# Altium schematic sheet 12.MiniPcie-4G.SchDoc
size A4; CheckedBy: YPC; DocumentNumber: 12; Revision: V1.00; SheetNumber: 12; SheetTotal: 18; SheetName: MiniPcie-4G; SheetDescribe: MiniPcie-4G/USB2.0; Designer: JOW; DesignDate: 2025-04-25; CheckedData: 2025-04-25; Rule: PcbType=ProtelPcb
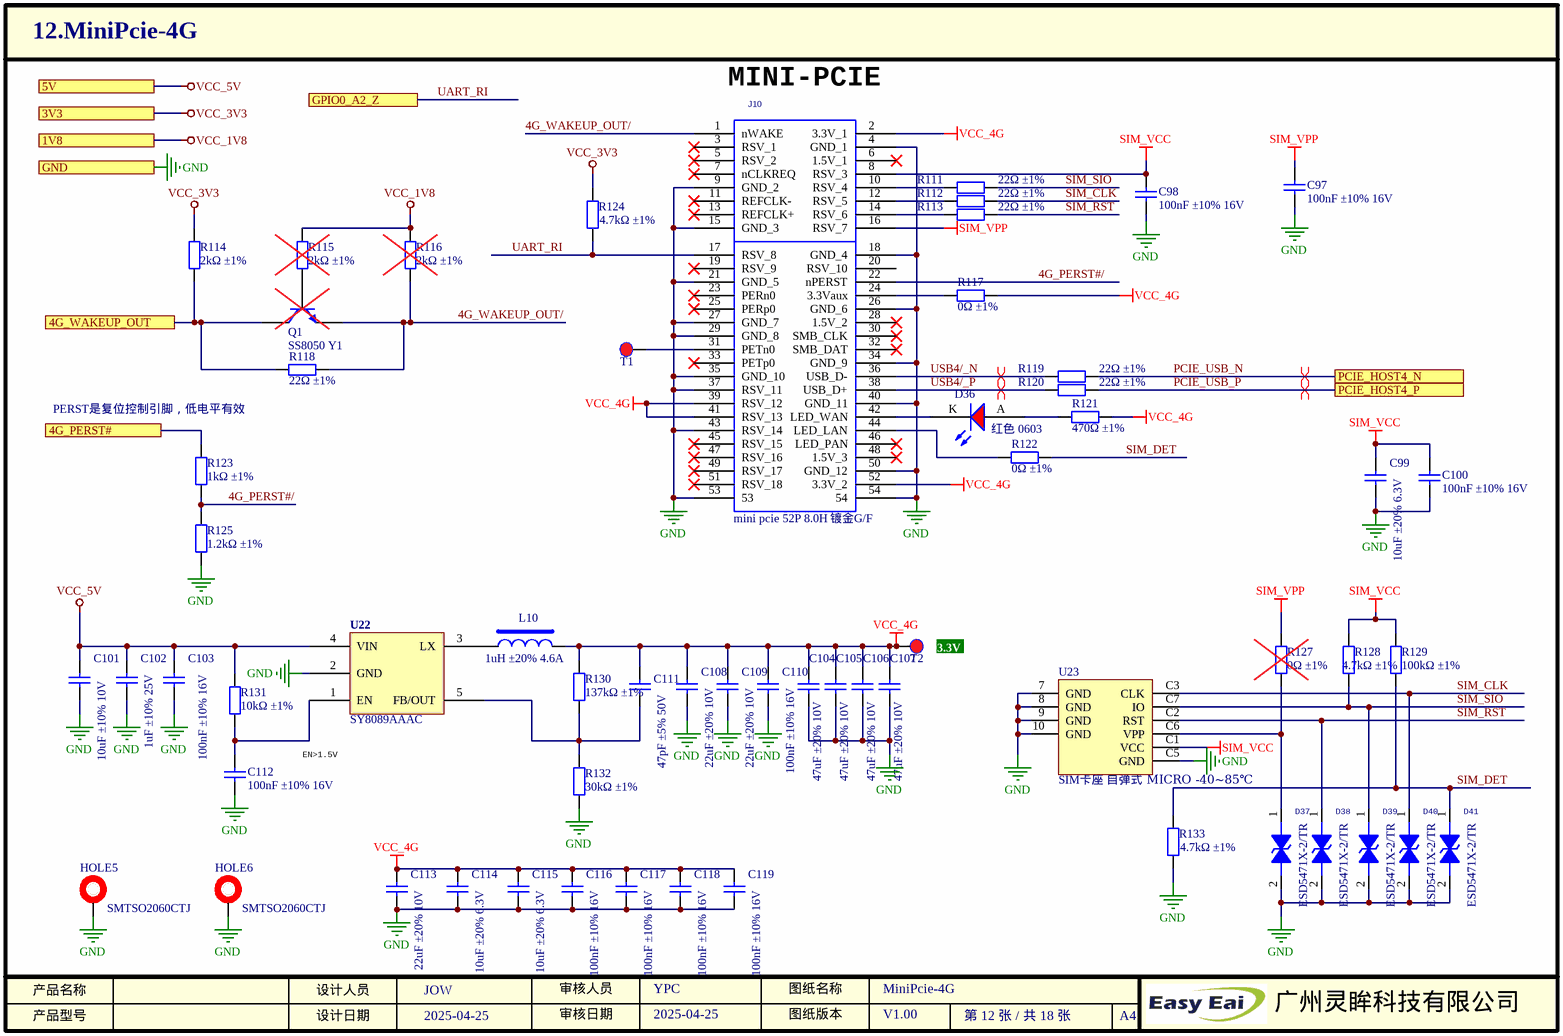
[diagram p0: 12.MiniPcie-4G.SchDoc]

## Parts
C97  描述: 100nF ±10% 16V  [0402_C]  (hidden comment: CL05B104KO5NNNC)
C98  描述: 100nF ±10% 16V  [0402_C]  (hidden comment: CL05B104KO5NNNC)
C99  描述: 10uF ±20% 6.3V  [0402_C]  (hidden comment: CL05A106MQ5NUNC)
C100  描述: 100nF ±10% 16V  [0402_C]  (hidden comment: CL05B104KO5NNNC)
C101  描述: 10uF ±10% 10V  [0603_C]  (hidden comment: CL10A106KP8NNNC)
C102  描述: 1uF ±10% 25V  [0402_C]  (hidden comment: CL05A105KA5NQNC)
C103  描述: 100nF ±10% 16V  [0402_C]  (hidden comment: CL05B104KO5NNNC)
C104  描述: 47uF ±20% 10V  [0805_C]  (hidden comment: C2012X5R1A476MTJ00E)
C105  描述: 47uF ±20% 10V  [0805_C]  (hidden comment: C2012X5R1A476MTJ00E)
C106  描述: 47uF ±20% 10V  [0805_C]  (hidden comment: C2012X5R1A476MTJ00E)
C107  描述: 47uF ±20% 10V  [0805_C]  (hidden comment: C2012X5R1A476MTJ00E)
C108  描述: 22uF ±20% 10V  [0603_C]  (hidden comment: CL10A226MP8NUNE)
C109  描述: 22uF ±20% 10V  [0603_C]  (hidden comment: CL10A226MP8NUNE)
C110  描述: 100nF ±10% 16V  [0402_C]  (hidden comment: CL05B104KO5NNNC)
C111  描述: 47pF ±5% 50V  [0402_C]  (hidden comment: NC/0402CG470J500NT)
C112  描述: 100nF ±10% 16V  [0402_C]  (hidden comment: CL05B104KO5NNNC)
C113  描述: 22uF ±20% 10V  [0603_C]  (hidden comment: CL10A226MP8NUNE)
C114  描述: 10uF ±20% 6.3V  [0402_C]  (hidden comment: CL05A106MQ5NUNC)
C115  描述: 10uF ±20% 6.3V  [0402_C]  (hidden comment: CL05A106MQ5NUNC)
C116  描述: 100nF ±10% 16V  [0402_C]  (hidden comment: CL05B104KO5NNNC)
C117  描述: 100nF ±10% 16V  [0402_C]  (hidden comment: CL05B104KO5NNNC)
C118  描述: 100nF ±10% 16V  [0402_C]  (hidden comment: CL05B104KO5NNNC)
C119  描述: 100nF ±10% 16V  [0402_C]  (hidden comment: CL05B104KO5NNNC)
D36  红色 0603  [0603_LED_S1]
D37  ESD5471X-2/TR  [FBP-02C]
D38  ESD5471X-2/TR  [FBP-02C]
D39  ESD5471X-2/TR  [FBP-02C]
D40  ESD5471X-2/TR  [FBP-02C]
D41  ESD5471X-2/TR  [FBP-02C]
HOLE5  SMTSO2060CTJ  [Mou Hole-373D600H-SMD]
HOLE6  SMTSO2060CTJ  [Mou Hole-373D600H-SMD]
J10  91304-80-052R2  [MEDC52-32F-PCIE-LOCK-L]  (value not drawn)
L10  WPN252010U1R0MT  [1008]  (value not drawn)
Q1  型号: SS8050 Y1  [SOT-23(SOT-23-3)]  (hidden comment: NC/SS8050 Y1)  (no BOM)
R111  描述: 22Ω ±1%  [0402_R]  (hidden comment: 0402WGF220JTCE)
R112  描述: 22Ω ±1%  [0402_R]  (hidden comment: 0402WGF220JTCE)
R113  描述: 22Ω ±1%  [0402_R]  (hidden comment: 0402WGF220JTCE)
R114  描述: 2kΩ ±1%  [0402_R]  (hidden comment: 0402WGF2001TCE)
R115  描述: 2kΩ ±1%  [0402_R]  (hidden comment: NC/0402WGF2001TCE)  (no BOM)
R116  描述: 2kΩ ±1%  [0402_R]  (hidden comment: NC/0402WGF2001TCE)  (no BOM)
R117  描述: 0Ω ±1%  [0402_R]  (hidden comment: 0402WGF0000TCE)
R118  描述: 22Ω ±1%  [0402_R]  (hidden comment: 0402WGF220JTCE)
R119  描述: 22Ω ±1%  [0402_R]  (hidden comment: 0402WGF220JTCE)
R120  描述: 22Ω ±1%  [0402_R]  (hidden comment: 0402WGF220JTCE)
R121  描述: 470Ω ±1%  [0402_R]  (hidden comment: AC0402FR-07470RL)
R122  描述: 0Ω ±1%  [0402_R]  (hidden comment: 0402WGF0000TCE)
R123  描述: 1kΩ ±1%  [0402_R]  (hidden comment: 0402WGF1001TCE)
R124  描述: 4.7kΩ ±1%  [0402_R]  (hidden comment: 0402WGF4701TCE)
R125  描述: 1.2kΩ ±1%  [0402_R]  (hidden comment: AC0402FR-071K2L)
R127  描述: 0Ω ±1%  [0402_R]  (hidden comment: NC/0402WGF0000TCE)  (no BOM)
R128  描述: 4.7kΩ ±1%  [0402_R]  (hidden comment: 0402WGF4701TCE)
R129  描述: 100kΩ ±1%  [0402_R]  (hidden comment: 0402WGF1003TCE)
R130  描述: 137kΩ ±1%  [0402_R]  (hidden comment: 0402WGF1373TCE)
R131  描述: 10kΩ ±1%  [0402_R]  (hidden comment: 0402WGF1002TCE)
R132  描述: 30kΩ ±1%  [0402_R]  (hidden comment: NQ02WGF3002TCE)
R133  描述: 4.7kΩ ±1%  [0402_R]  (hidden comment: 0402WGF4701TCE)
T1  TEST-DOT  [PAD-25/40]  (value not drawn)
T2  TEST-DOT  [PAD-25/40]  (value not drawn)
U22  SY8089AAAC  [SOT-23-5]
U23  描述: SIM卡座 自弹式 MICRO -40~85℃  [SIM-SMD_SMC-202-6]  (hidden comment: SMC-202-6)

## Ports
1V8, 3V3, 4G_PERST#, 4G_WAKEUP_OUT, 5V, GND, GPIO0_A2_Z, PCIE_HOST4_N, PCIE_HOST4_P

## Nets
GND: C97.1 C98.1 C99.1 C100.1 C101.1 C102.1 C103.1 C104.1 C105.1 C106.1 C107.1 C108.1 C109.1 C110.1 C112.1 C113.1 C114.1 C115.1 C116.1 C117.1 C118.1 C119.1 D37.2 D38.2 D39.2 D40.2 D41.2 HOLE5.1 HOLE6.1 J10.4(GND_1) J10.9(GND_2) J10.15(GND_3) J10.18(GND_4) J10.21(GND_5) J10.26(GND_6) J10.27(GND_7) J10.29(GND_8) J10.34(GND_9) J10.35(GND_10) J10.37(RSV_11) J10.40(GND_11) J10.43(RSV_14) J10.50(GND_12) J10.53 J10.54 R125.1 R132.1 R133.1 U22.2(GND) U23.7(GND) U23.8(GND) U23.9(GND) U23.10(GND) U23.C5(GND) ; port GND
SIM_VCC: C98.2 C99.2 C100.2 J10.8(RSV_3) R128.2 R129.2 U23.C1(VCC)
SIM_VPP: C97.2 J10.16(RSV_7) R127.2
VCC_1V8: R115.2 R116.2 ; port 1V8
VCC_3V3: R114.2 R124.2 ; port 3V3
VCC_4G: C104.2 C105.2 C106.2 C107.2 C108.2 C109.2 C110.2 C111.2 C113.2 C114.2 C115.2 C116.2 C117.2 C118.2 C119.2 J10.2(3.3V_1) J10.39(RSV_12) J10.41(RSV_13) J10.52(3.3V_2) L10.2 R117.2 R121.2 R130.2 T2.1
VCC_5V: C101.2 C102.2 C103.2 R131.2 U22.4(VIN) ; port 5V
4G_PERST#: R123.2 ; port 4G_PERST#
4G_PERST#/: J10.22(nPERST) R123.1 R125.2
4G_WAKEUP_OUT: Q1.3(C) R114.1 R118.1 ; port 4G_WAKEUP_OUT
4G_WAKEUP_OUT/: J10.1(nWAKE) Q1.2(E) R116.1 R118.2
PCIE_USB_N: R119.2 ; port PCIE_HOST4_N
PCIE_USB_P: R120.2 ; port PCIE_HOST4_P
SIM_CLK: D40.1 R112.2 U23.C3(CLK)
SIM_DET: D41.1 R122.2 R129.1 R133.2
SIM_RST: D38.1 R113.2 U23.C2(RST)
SIM_SIO: D39.1 R111.2 R128.1 U23.C7(IO)
UART_RI: J10.17(RSV_8) R124.1 ; port GPIO0_A2_Z
USB4/_N: J10.36(USB_D-) R119.1
USB4/_P: J10.38(USB_D+) R120.1
NetC111_1: C111.1 R130.1 R132.2 U22.5(FB/OUT)
NetC112_2: C112.2 R131.1 U22.1(EN)
NetD36_A: D36.A R121.1
NetD36_K: D36.K J10.42(LED_WAN)
NetD37_1: D37.1 R127.1 U23.C6(VPP)
NetJ10_10: J10.10(RSV_4) R111.1
NetJ10_12: J10.12(RSV_5) R112.1
NetJ10_14: J10.14(RSV_6) R113.1
NetJ10_24: J10.24(3.3Vaux) R117.1
NetJ10_31: J10.31(PETn0) T1.1
NetJ10_44: J10.44(LED_LAN) R122.1
NetL10_1: L10.1 U22.3(LX)
NetQ1_1: Q1.1(B) R115.1

Not connected (* = marked no-connect by the designer): J10 3(RSV_1)* 5(RSV_2)* 6(1.5V_1)* 7(nCLKREQ)* 11(REFCLK-)* 13(REFCLK+)* 19(RSV_9)* 20(RSV_10) 23(PERn0)* 25(PERp0)* 28(1.5V_2)* 30(SMB_CLK)* 32(SMB_DAT)* 33(PETp0)* 45(RSV_15)* 46(LED_PAN)* 47(RSV_16)* 48(1.5V_3)* 49(RSV_17)* 51(RSV_18)*

## Layout directives
differential pair: PCIE_USB_N, PCIE_USB_P, USB4/_N, USB4/_P

## Notes on the sheet
- (near J10) MINI-PCIE
- PERST是复位控制引脚，低电平有效
- (near T2) 3.3V
- EN>1.5V
- 产品名称
- 产品型号
- 设计人员
- 设计日期
- 审核人员
- 审核日期
- 图纸版本
- 图纸名称
- A4
- 广州灵眸科技有限公司

## Library data of the parts
C97 C98 C100 C103 C110 C112 C116-C119 = 0402 100nF ±10% 16V: SPZL000259; 名称: 贴片电容; 厂商: SAMSUNG(三星); 封装: 0402; 工作温度: -55~125℃; 贴片和直插: SMD; 型号: CL05B104KO5NNNC; SuppliersPartNumber: C1525; 商品编号: SPZL000259
C99 C114 C115 = 0402 10uF ±20% 6.3V: SPZL000269; 名称: 贴片电容; 厂商: SAMSUNG(三星); 封装: 0402; 工作温度: -55~85℃; 贴片和直插: SMD; 型号: CL05A106MQ5NUNC; SuppliersPartNumber: C15525; 商品编号: SPZL000269
C101 = 0603 10uF ±10% 10V: SPZL000260; 名称: 贴片电容; 厂商: SAMSUNG(三星); 封装: 0603; 工作温度: -55~85℃; 贴片和直插: SMD; 型号: CL10A106KP8NNNC; SuppliersPartNumber: C19702; 商品编号: SPZL000260
C102 = 0402 1uF ±10% 25V: SPZL000337; 名称: 贴片电容; 厂商: SAMSUNG(三星); 封装: 0402; 工作温度: -55~85℃; 贴片和直插: SMD; 型号: CL05A105KA5NQNC; SuppliersPartNumber: C52923; 商品编号: SPZL000337
C104-C107 = 0805 47uF ±20% 10V: SPZL001333; 名称: 贴片电容; 厂商: TDK; 封装: 0805; 工作温度: -55~85℃; 贴片和直插: SMD; 型号: C2012X5R1A476MTJ00E; SuppliersPartNumber: C76636; 商品编号: SPZL001333
C108 C109 C113 = 0603 22uF ±20% 10V: SPZL000315; 名称: 贴片电容; 厂商: SAMSUNG(三星); 封装: 0603; 工作温度: -55~85℃; 贴片和直插: SMD; 型号: CL10A226MP8NUNE; SuppliersPartNumber: C86295; 商品编号: SPZL000315
C111 = 0402 47pF ±5% 50V: SPZL000882; 名称: 贴片电容; 厂商: FH(风华); 封装: 0402; 工作温度: -55~125℃; 贴片和直插: SMD; 型号: 0402CG470J500NT; SuppliersPartNumber: C1567; 商品编号: SPZL000882
D36 = 红色 0603: SPZL000214; 厂商: EVERLIGHT(台湾亿光); 封装: 0603; 贴片和直插: SMD; 型号: 19-217/R6C-AL1M2VY/3T; 名称: LED; 工作温度: -40~85℃; SuppliersPartNumber: C72044; 商品编号: SPZL000214; 描述: 红色 0603
D37-D41 = TVS ESD5471X-2/TR: SPZL000254; 名称: TVS; 贴片和直插: SMD; 厂商: WillSemi(韦尔半导体); 描述: Vdrm=5V Cj=9pF; 工作温度: -40~85℃; SuppliersPartNumber: C239631; 封装: FBP-02C; 商品编号: SPZL000254; 型号: ESD5471X-2/TR
HOLE5 HOLE6 = 螺柱 SMTSO-M2-6ET: SPZL000166; 名称: 螺柱; 封装: SMD; 厂商: 雄和远景; 描述: 螺丝孔径2mm 高6mm; 贴片和直插: SMD; SuppliersPartNumber: *; 工作温度: *; 型号: SMTSO2060CTJ; 商品编号: SPZL000166
J10 = mini pcie 52P 8.0H 镀金G/F: SPZL000136; 名称: MiniPCIe座子; 封装: SMD; 厂商: UMaxconn; 贴片和直插: SMD; SuppliersPartNumber: C404124; 型号: 91304-80-052R2; 商品编号: SPZL000136; 工作温度: *; 描述: mini pcie 52P 8.0H 镀金G/F
L10 = 1uH ±20% 4.6A: SPZL000872; 名称: 电感; 厂商: Sunlord(顺络); 贴片和直插: SMD; 工作温度: -40~125℃; 封装: 1008; 型号: WPN252010U1R0MT; SuppliersPartNumber: C279952; 商品编号: SPZL000872; 描述: 1uH ±20% 4.6A
Q1 = NPN SS8050 Y1: 封装: SOT-23; 厂商: CJ（江苏长电/长晶）; 名称: 三极管; 贴片和直插: SMD; 描述: NPN 25V 1.5A; 工作温度: -55~150℃; SuppliersPartNumber: C2150
R111-R113 R118-R120 = 0402 22Ω ±1%: SPZL000279; 封装: 0402; 厂商: UNI-ROYAL(厚声); 贴片和直插: SMD; 名称: 电阻; 工作温度: -55~155℃; SuppliersPartNumber: C25092; 型号: 0402WGF220JTCE; 商品编号: SPZL000279
R114 = 0402 2kΩ ±1%: SPZL000278; 封装: 0402; 厂商: UNI-ROYAL(厚声); 贴片和直插: SMD; 名称: 电阻; 工作温度: -55~155℃; SuppliersPartNumber: C4109; 型号: 0402WGF2001TCE; 商品编号: SPZL000278
R115 R116 = 0402 2kΩ ±1%: 封装: 0402; 厂商: UNI-ROYAL(厚声); 贴片和直插: SMD; 名称: 电阻; 工作温度: -55~155℃; SuppliersPartNumber: C4109; 型号: 0402WGF2001TCE
R117 R122 = 0402 0Ω ±1%: SPZL000276; 封装: 0402; 厂商: UNI-ROYAL(厚声); 贴片和直插: SMD; 名称: 电阻; 工作温度: -55~125℃; SuppliersPartNumber: C17168; 型号: 0402WGF0000TCE; 商品编号: SPZL000276
R121 = 0402 470Ω ±1%: SPZL000329; 封装: 0402; 厂商: YAGEO(国巨); 贴片和直插: SMD; 名称: 电阻; 工作温度: -55~155℃; SuppliersPartNumber: C227095; 型号: AC0402FR-07470RL; 商品编号: SPZL000329
R123 = 0402 1kΩ ±1%: SPZL000275; 封装: 0402; 厂商: UNI-ROYAL(厚声); 贴片和直插: SMD; 名称: 电阻; 工作温度: -55~125℃; SuppliersPartNumber: C11702; 型号: 0402WGF1001TCE; 商品编号: SPZL000275
R124 R128 R133 = 0402 4.7kΩ ±1%: SPZL000280; 封装: 0402; 厂商: UNI-ROYAL(厚声); 贴片和直插: SMD; 名称: 电阻; 工作温度: -55~155℃; SuppliersPartNumber: C25900; 型号: 0402WGF4701TCE; 商品编号: SPZL000280
R125 = 0402 1.2kΩ ±1%: SPZL000328; 封装: 0402; 厂商: YAGEO(国巨); 贴片和直插: SMD; 名称: 电阻; 工作温度: -55~125℃; SuppliersPartNumber: C144793; 型号: AC0402FR-071K2L; 商品编号: SPZL000328
R127 = 0402 0Ω ±1%: 封装: 0402; 厂商: UNI-ROYAL(厚声); 贴片和直插: SMD; 名称: 电阻; 工作温度: -55~125℃; SuppliersPartNumber: C17168; 型号: 0402WGF0000TCE
R129 = 0402 100kΩ ±1%: SPZL000282; 封装: 0402; 厂商: UNI-ROYAL(厚声); 贴片和直插: SMD; 名称: 电阻; 工作温度: -55~155℃; SuppliersPartNumber: C25741; 型号: 0402WGF1003TCE; 商品编号: SPZL000282
R130 = 0402 137kΩ ±1%: SPZL000322; 封装: 0402; 厂商: UNI-ROYAL(厚声); 贴片和直插: SMD; 名称: 电阻; 工作温度: -55~155℃; SuppliersPartNumber: C32298; 型号: 0402WGF1373TCE; 商品编号: SPZL000322
R131 = 0402 10kΩ ±1%: SPZL000271; 封装: 0402; 厂商: UNI-ROYAL(厚声); 贴片和直插: SMD; 名称: 电阻; 工作温度: -55~155℃; SuppliersPartNumber: C25744; 型号: 0402WGF1002TCE; 商品编号: SPZL000271
R132 = 0402 30kΩ ±1%: SPZL000323; 封装: 0402; 厂商: UNI-ROYAL(厚声); 贴片和直插: SMD; 名称: 电阻; 工作温度: -55~155℃; SuppliersPartNumber: C965267; 型号: NQ02WGF3002TCE; 商品编号: SPZL000323
U22 = SY8089AAAC: SPZL000040; 名称: 电源IC; 厂商: silergy(矽力杰); 贴片和直插: SMD; 描述: DC-DC; 工作温度: -40~85℃; 封装: SOT-23-5; SuppliersPartNumber: C78988; 商品编号: SPZL000040; 型号: SY8089AAAC
U23 = SIM卡座 自弹式 MICRO: SPZL001068; 名称: SIM卡座; 贴片和直插: SMD; 厂商: XUNPU(讯普); 工作温度: -40~85℃; SuppliersPartNumber: C266634; 封装: SMD; 型号: SMC-202-6; 商品编号: SPZL001068